# Altium schematic sheet GPS_IMU_SENSORS.SchDoc: Gransmaster GPS & IMU
size Tabloid; Author: N Smith; Revision: A; SheetNumber: 5; SheetTotal: 7; Customer: 01910
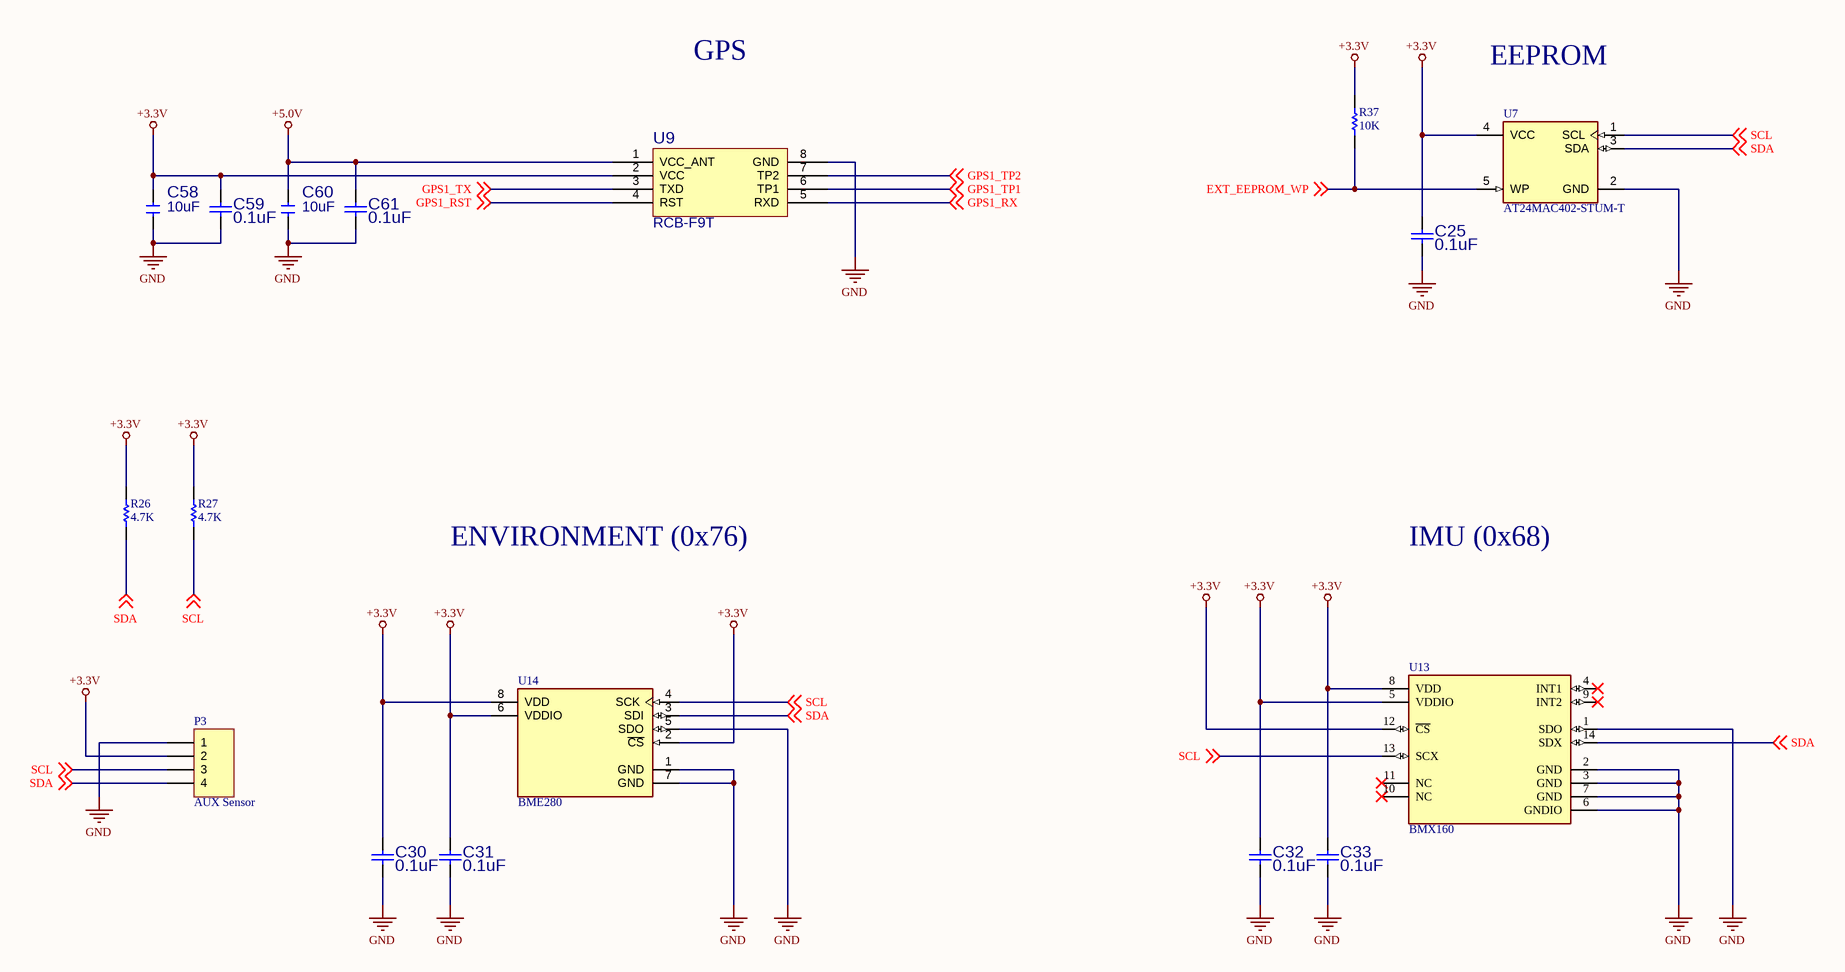
[diagram p0: GPS_IMU_SENSORS.SchDoc]

## Parts
C25  0.1uF  [CAPC1608X87X45ML20T05]
C30  0.1uF  [CAPC1608X87X45ML20T05]
C31  0.1uF  [CAPC1608X87X45ML20T05]
C32  0.1uF  [CAPC1608X87X45ML20T05]
C33  0.1uF  [CAPC1608X87X45ML20T05]
C58  value 10uF  [CAPC2012X14N]  (hidden comment: CAP_0805_10UF_25V)
C59  0.1uF  [CAPC1608X87X45ML20T05]
C60  value 10uF  [CAPC2012X14N]  (hidden comment: CAP_0805_10UF_25V)
C61  0.1uF  [CAPC1608X87X45ML20T05]
P3  AUX Sensor  [HDR1X4]
R26  4.7K  [RESC1608X55X30NL15T15]
R27  4.7K  [RESC1608X55X30NL15T15]
R37  10K  [RESC1608X55X30LL15T20]
U7  AT24MAC402-STUM-T  [FP-5TS1-IPC_C]
U9  RCB-F9T  [GNSS]
U13  BMX160  [FP-BMX160-MFG]
U14  BME280  [FP-BME280-MFG]

## Nets
+3.3V: C25.2 C30.2 C31.2 C32.2 C33.2 C58.1 C59.2 P3.2 R26.2 R27.2 R37.2 U7.4(VCC) U9.2(VCC) U13.5(VDDIO) U13.8(VDD) U13.12(~{CS}) U14.2(~{CS}) U14.6(VDDIO) U14.8(VDD)
+5.0V: C60.1 C61.2 U9.1(VCC_ANT)
GND: C25.1 C30.1 C31.1 C32.1 C33.1 C58.2 C59.1 C60.2 C61.1 P3.1 U7.2(GND) U9.8(GND) U13.1(SDO) U13.2(GND) U13.3(GND) U13.6(GNDIO) U13.7(GND) U14.1(GND) U14.5(SDO) U14.7(GND)
EXT_EEPROM_WP: R37.1 U7.5(WP) ; off-sheet EXT_EEPROM_WP
GPS1_RST: U9.4(RST) ; off-sheet GPS1_RST
GPS1_RX: U9.5(RXD) ; off-sheet GPS1_RX
GPS1_TP1: U9.6(TP1) ; off-sheet GPS1_TP1
GPS1_TP2: U9.7(TP2) ; off-sheet GPS1_TP2
GPS1_TX: U9.3(TXD) ; off-sheet GPS1_TX
SCL: P3.3 R27.1 U7.1(SCL) U13.13(SCX) U14.4(SCK) ; off-sheet SCL
SDA: P3.4 R26.1 U7.3(SDA) U13.14(SDX) U14.3(SDI) ; off-sheet SDA

Not connected (* = marked no-connect by the designer): U13 4(INT1)* 9(INT2)* 10(NC)* 11(NC)*

## Notes on the sheet
- GPS
- EEPROM
- ENVIRONMENT (0x76)
- IMU (0x68)
- SHEET
- timingcard.com <http://timingcard.com>
- OF

## Library data of the parts
C25 C30-C33 C59 C61 = CMP-2006-00003-1: C0603X104K5RACAUTO; Manufacturer: Kemet; Part Number: C0603X104K5RACAUTO
C58 C60 = CAP_0805_10UF_25V: CAP, CER, 10.UF, 25V, 10%, X5R, 0805; MFG PART NUM: TMK212BBJ106KG-T; VALENTIUM PART NUM: <VALENTIUM>; MFG NAME: TAIYO YUDEN; MAXTEMP: 85C; MINTEMP: -55C; DESC: CAP, CER, 10.UF, 10V, 10%, X5R, 0805; MODIFY DATE: 10/23/2013; CATEGORY: CAP, CER; Date: 4/11/2006 3:37:28 PM; SHEETPART: *; P1: 10%; P2: 25V; P3: X5R; Size: 0805; Supplier 1: MOUSER; Supplier Part Number 1: 963-TMK212BBJ106KG-T
P3 = Header 4: Header, 4-Pin; LatestRevisionDate: 17-Jul-2002; LatestRevisionNote: Re-released for DXP Platform.; Publisher: Altium Limited
R26 R27 = CMP-1012-00586-3: Precision Thick Film Chip Resistor, 4.7 KOhm, +/- 1%, -55 to 155 degC, 0603 (1608 Metric), RoHS, Tape and Reel ERJ-3EKF4701V; Resistance: 220 Ohm; Voltage Rating: 50 V; Elements: 4; Case\Package: 1205; Tolerance: 5%; Power Rating: 250 mW; PackageReference: 0603; Max Operating Temperature: 125 degC; REACH SVHC: No SVHC; Width: 0.063 inch; Length: 0.126 inch; Height: 0.024 inch; Mount: Surface Mount; Package Quantity: 1; DatasheetVersion: Apr-15; ComponentLink1Description: Manufacturer URL; Min Operating Temperature: -55 degC; Packaging: Tape and Reel; Radiation Hardening: No; ComponentLink2URL: http://industrial.panasonic.com/cdbs/www-data/pdf/RDA0000/AOA0000C86.pdf; Case Code (Metric): 3216; Pins: 8; Case Code (Imperial): 1206; Type (Resistor): Thick Film; RoHSCompliant: true; ComponentLink2Description: Datasheet; PackageDescription: 2-Pin Surface Mount Device, Body 1.6 x 0.85 mm; ComponentLink1URL: http://www.panasonic.com/
R37 = CMP-2000-06990-1: Chip Resistor, 10 KOhm, +/- 1%, 0.1 W, -55 to 155 degC, 0603 (1608 Metric), RoHS, Tape and Reel RMCF0603FT10K0; Manufacturer: Stackpole-Electronics-Inc.; Temperature Coefficient: ±100ppm/°C; Power (Watts): 0.1W,1/10W; Package / Case: 0603(1608Metric); Datasheet Version: 01/2017; Resistance (Ohms): 10k; Features: AutomotiveAEC-Q200; Packaging: CutTape(CT); Series: RMCF; Height: 0.022"(0.55mm); Tolerance: ±1%; Manufacturer URL: https://www.seielect.com/; Datasheet URL: https://www.seielect.com/Catalog/SEI-RMCF_RMCP.pdf; Supplier Device Package: 0603; Number of Terminations: 2; Family: ChipResistor-SurfaceMount; Package Reference: 0603; Size / Dimension: 0.061"Lx0.031"W(1.55mmx0.80mm); Mounting Technology: SurfaceMount; Package Description: 2-Pin Surface Mount Device, Body 1.55 x 0.8 mm; Operating Temperature: -55°C~155°C; Composition: ThickFilm; Category: Resistors
U7 = CMP-06313-000011-1: IC EEPROM 2K I2C 1MHZ SOT23-5; Manufacturer: Microchip; Memory Size: 2Kbits; Min Supply Voltage: 1.7V; Max Supply Voltage: 5.5V; Frequency: 1000kHz; Standoff Height: 0mm; Nominal Supply Current: 0.4-2mA; Access Time: 0.55us; Interface: I2C,2-Wire; Temperature Range Low: -40°C; Height: 1mm; ComponentLink2URL: http://ww1.microchip.com/downloads/en/DeviceDoc/Atmel-8807-SEEPROM-AT24MAC402-602-Datasheet.pdf; Ipc Land Pattern Name: SOT95P280X100-5; Category: IC; Memory Type: EEPROM; Digikey Description: IC EEPROM 2K I2C 1MHZ SOT23-5; Manufacturer Part Number: AT24MAC402-STUM-T; Device Class L1: Integrated Circuits (ICs); Temperature Range High: +85°C; ComponentLink2Description: Datasheet; RoHS: TRUE; Mouser Description: EEPROM Serial-I2C 2K-bit 256 x 8 1.8V/2.5V/3.3V/5V 5-Pin SOT-23 T/R; Octopart: https://octopart.com/at24mac402-stum-t-microchip-77758112; Temperature: -40°C to +85°C; Package: 5TS1; Device Class L3: EEPROM; Automotive: No; Device Class L2: Memory; Lead Free: Yes
U9 = RCB-F9T: MOD, GPS; VELENTIUM PART NUM: <V PART NUM>; MFG NAME: UBLOCKS; MINTEMP: -40C; MAXTEMP: 80C; DESC: MOD BLE 4.2; MFG PART NUM: RCB-F9T; CATEGORY: MOD; MODIFY DATE: 9/11/13; P1: GPS; SHEETPART: *; DATE: .; Supplier 1: Digi-Key; Supplier Part Number 1: 672-RCB-F9T-ND
U13 = CMP-191067-000010-1: IMU ACCEL/GYRO/MAG; Output Type: SPI; Sensor Type: Accelerometer; Number of Pins: 14; Max Operating Temperature: 85°C; Mount: Surface Mount; Case/Package: LGA; Packaging: Tape and Reel; Min Operating Temperature: -40°C
U14 = CMP-2000-05073-3: SENSOR PRESSURE HUMIDITY TEMP; Sensor Type: Temperature; Accuracy: 3%; Response Time: 1s; Output Type: SPI; Min Operating Temperature: -40°C; Max Operating Temperature: 85°C; Case/Package: LGA; Packaging: Cut Tape; Mount: Surface Mount; Lead Free: Lead Free; Number of Pins: 8